# EAGLE design ramanPi_controlBoard (EAGLE 6.2)
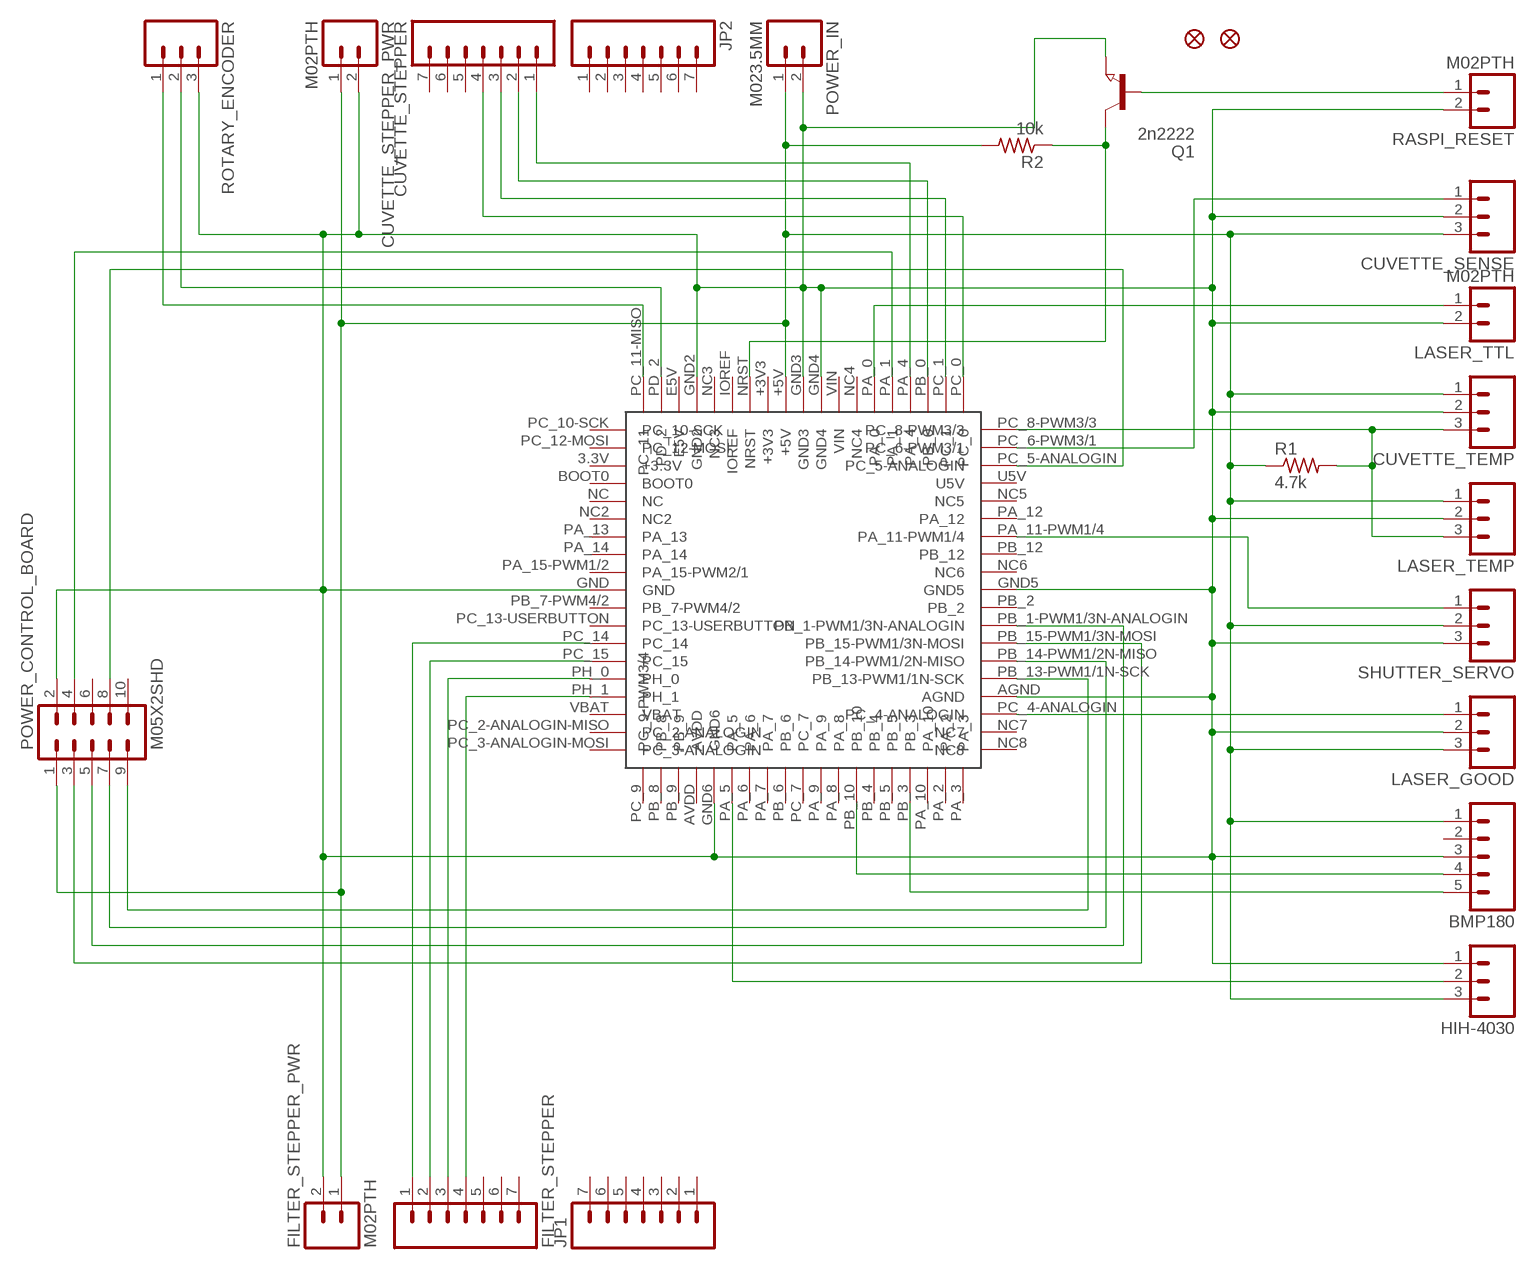
[diagram p0: schematic, sheet 1]

## Parts
BMP180  M05PTH  [1X05]
CUVETTE_SENSE  M03PTH  [1X03]
CUVETTE_STEPPER  M07  [1X07]
CUVETTE_STEPPER_PWR  M02PTH  [1X02]
CUVETTE_TEMP  M03PTH  [1X03]
FID1  FIDUCIAL1X2  [FIDUCIAL-1X2]
FID2  FIDUCIAL1X2  [FIDUCIAL-1X2]
FILTER_STEPPER  M07  [1X07]
FILTER_STEPPER_PWR  M02PTH  [1X02]
HIH-4030  M03PTH  [1X03]
JP1  M07  [1X07]
JP2  M07  [1X07]
LASER_GOOD  M03PTH  [1X03]
LASER_TEMP  M03PTH  [1X03]
LASER_TTL  M02PTH  [1X02]
POWER_CONTROL_BOARD  M05X2SHD  [2X5-SHROUDED]
POWER_IN  M023.5MM  [SCREWTERMINAL-3.5MM-2]
Q1  2n2222  NPN-TRANSISTOR_SOT23  [SOT23]
R1  4.7k  R-US_M1206  [M1206]
R2  10k  R-US_M1206  [M1206]
RASPI_RESET  M02PTH  [1X02]
ROTARY_ENCODER  M03PTH  [1X03]
SHUTTER_SERVO  M03PTH  [1X03]
U$1  STNUCLEOF401RE  [F401-RE]

## Nets
+5V: BMP180.1 CUVETTE_SENSE.3 CUVETTE_STEPPER_PWR.1 CUVETTE_TEMP.1 FILTER_STEPPER_PWR.1 HIH-4030.3 LASER_GOOD.3 LASER_TEMP.1 POWER_CONTROL_BOARD.1 POWER_IN.1 R1.1 R2.2 SHUTTER_SERVO.2 U$1.+5V
GROUND: BMP180.3 CUVETTE_SENSE.2 CUVETTE_STEPPER_PWR.2 CUVETTE_TEMP.2 FILTER_STEPPER_PWR.2 HIH-4030.1 LASER_GOOD.2 LASER_TEMP.2 LASER_TTL.2 POWER_CONTROL_BOARD.2 POWER_IN.2 Q1.2(E) RASPI_RESET.2 ROTARY_ENCODER.3 SHUTTER_SERVO.3 U$1.AGND U$1.GND U$1.GND2 U$1.GND3 U$1.GND4 U$1.GND5 U$1.GND6
N$1: BMP180.5 U$1.PB_3
N$2: BMP180.4 U$1.PB_10
N$4: CUVETTE_SENSE.1 U$1.PC_6-PWM3/1
N$5: HIH-4030.2 U$1.PA_5
N$6: CUVETTE_TEMP.3 LASER_TEMP.3 R1.2 U$1.PC_8-PWM3/3
N$7: POWER_CONTROL_BOARD.4 U$1.PA_1
N$8: LASER_TTL.1 U$1.PA_0
N$9: POWER_CONTROL_BOARD.3 U$1.PB_15-PWM1/3N-MOSI
N$10: POWER_CONTROL_BOARD.5 U$1.PB_1-PWM1/3N-ANALOGIN
N$11: POWER_CONTROL_BOARD.7 U$1.PB_14-PWM1/2N-MISO
N$12: POWER_CONTROL_BOARD.9 U$1.PB_13-PWM1/1N-SCK
N$13: POWER_CONTROL_BOARD.8 U$1.PC_5-ANALOGIN
N$14: SHUTTER_SERVO.1 U$1.PA_11-PWM1/4
N$15: LASER_GOOD.1 U$1.PC_4-ANALOGIN
N$16: FILTER_STEPPER.1 U$1.PC_14
N$17: FILTER_STEPPER.2 U$1.PC_15
N$18: FILTER_STEPPER.3 U$1.PH_0
N$19: FILTER_STEPPER.4 U$1.PH_1
N$20: CUVETTE_STEPPER.1 U$1.PA_4
N$21: CUVETTE_STEPPER.2 U$1.PB_0
N$22: CUVETTE_STEPPER.3 U$1.PC_1
N$23: CUVETTE_STEPPER.4 U$1.PC_0
N$24: ROTARY_ENCODER.1 U$1.PC_11-MISO(PC_11)
N$25: ROTARY_ENCODER.2 U$1.PD_2
N$49: Q1.3(C) R2.1 U$1.NRST
N$50: Q1.1(B) RASPI_RESET.1
Unconnected: BMP180.2 CUVETTE_STEPPER.5 CUVETTE_STEPPER.6 CUVETTE_STEPPER.7 FILTER_STEPPER.5 FILTER_STEPPER.6 FILTER_STEPPER.7 JP1.1 JP1.2 JP1.3 JP1.4 JP1.5 JP1.6 JP1.7 JP2.1 JP2.2 JP2.3 JP2.4 JP2.5 JP2.6 JP2.7 POWER_CONTROL_BOARD.6 POWER_CONTROL_BOARD.10 U$1.BOOT0 U$1.IOREF U$1.NC U$1.NC2 U$1.NC3 U$1.NC4 U$1.NC5 U$1.NC6 U$1.NC7 U$1.NC8 U$1.PA_2 U$1.PA_3 U$1.PA_6 U$1.PA_7 U$1.PA_8 U$1.PA_9 U$1.PA_10 U$1.PA_12 U$1.PA_13 U$1.PA_14 U$1.PA_15-PWM1/2(PA_15-PWM2/1) U$1.PB_2 U$1.PB_4 U$1.PB_5 U$1.PB_6 U$1.PB_7-PWM4/2 U$1.PB_8 U$1.PB_9 U$1.PB_12 U$1.PC_2-ANALOGIN-MISO(PC_2-ANALOGIN) U$1.PC_3-ANALOGIN-MOSI(PC_3-ANALOGIN) U$1.PC_7 U$1.PC_9(PC_9-PWM3/4) U$1.PC_10-SCK U$1.PC_12-MOSI U$1.PC_13-USERBUTTON

## Power pins joined to a net without a drawn wire
+3.3V: U$1.3.3V(+3.3V)
+3V3: U$1.+3V3
AVDD: U$1.AVDD
E5V: U$1.E5V
U5V: U$1.U5V
VBAT: U$1.VBAT
VIN: U$1.VIN

## Library data of the parts
BMP180 = SparkFun-Connectors:M05: Header 5 Standard 5-pin 0.1" header. Use with straight break away headers (SKU : PRT-00116), right angle break away headers (PRT-00553), swiss pins (PRT-00743), machine pins (PRT-00117), and female headers (PRT-00115). Molex polarized connector foot print use with SKU : PRT-08230 with associated crimp pins and housings.
CUVETTE_SENSE CUVETTE_TEMP HIH-4030 LASER_GOOD LASER_TEMP ROTARY_ENCODER SHUTTER_SERVO = SparkFun-Connectors:M03: Header 3 Standard 3-pin 0.1" header. Use with straight break away headers (SKU : PRT-00116), right angle break away headers (PRT-00553), swiss pins (PRT-00743), machine pins (PRT-00117), and female headers (PRT-00115). Molex polarized connector foot print use with SKU : PRT-08232 with associated crimp pins and housings.
CUVETTE_STEPPER FILTER_STEPPER JP1 JP2 = SparkFun-Connectors:M07: Header 7 Standard 7-pin 0.1" header. Use with straight break away headers (SKU : PRT-00116), right angle break away headers (PRT-00553), swiss pins (PRT-00743), machine pins (PRT-00117), and female headers (PRT-00115). NOTES ON THE VARIANTS LOCK and LOCK_LONGPADS... This footprint was designed to help hold the alignment of a through-hole component (i.e. 7-pin header) while soldering it into place. You may notice that each hole has been shifted either up or down by 0.005 of an inch from it's more standard position (which is usually a perfectly straight line). This slight alteration caused the pins (the squares in the middle) to touch the edges of the holes. Because they are alternating, it causes a "brace" to hold the header in place. 0.005 has proven to be the perfect amount of "off-center" position when using our standard breakaway headers. Although looks a little odd when you look at the bare footprint, once you have a header in there, the alteration is very hard to notice. Also, if you push a header all the way into place, it is covered up entirely on the bottom side. This idea of altering the position of holes to aid alignment will be further integrated into the Sparkfun Library for other footprints. It can help hold any component with 3 or more connection pins.
CUVETTE_STEPPER_PWR FILTER_STEPPER_PWR LASER_TTL POWER_IN RASPI_RESET = SparkFun-Connectors:M02: Standard 2-pin 0.1" header. Use with - straight break away headers ( PRT-00116) - right angle break away headers (PRT-00553) - swiss pins (PRT-00743) - machine pins (PRT-00117) - female headers (PRT-00115) Molex polarized connector foot print use with: PRT-08233 with associated crimp pins and housings. 2.54_SCREWTERM for use with PRT-10571. 3.5mm Screw Terminal footprints for PRT-08084 5mm Screw Terminal footprints for use with PRT-08433
FID1 FID2 = SparkFun-Aesthetics:FIDUCIAL: Fiducial Alignment Points Various fiducial points for machine vision alignment.
POWER_CONTROL_BOARD = SparkFun-Connectors:M05X2: Header 5x2 Standard 10-pin dual row 0.1" header. Commonly used with AVR-ISP. Use with Spark Fun Electronics SKU: PRT-00778
Q1 = semicon-smd-ipc:NPN-TRANSISTOR_: NPN TRANSISTOR
R1 R2 = adafruit:R-US_: RESISTOR, American symbol
U$1 = nucleoF401RE:STNUCLEOF401RE

## Board
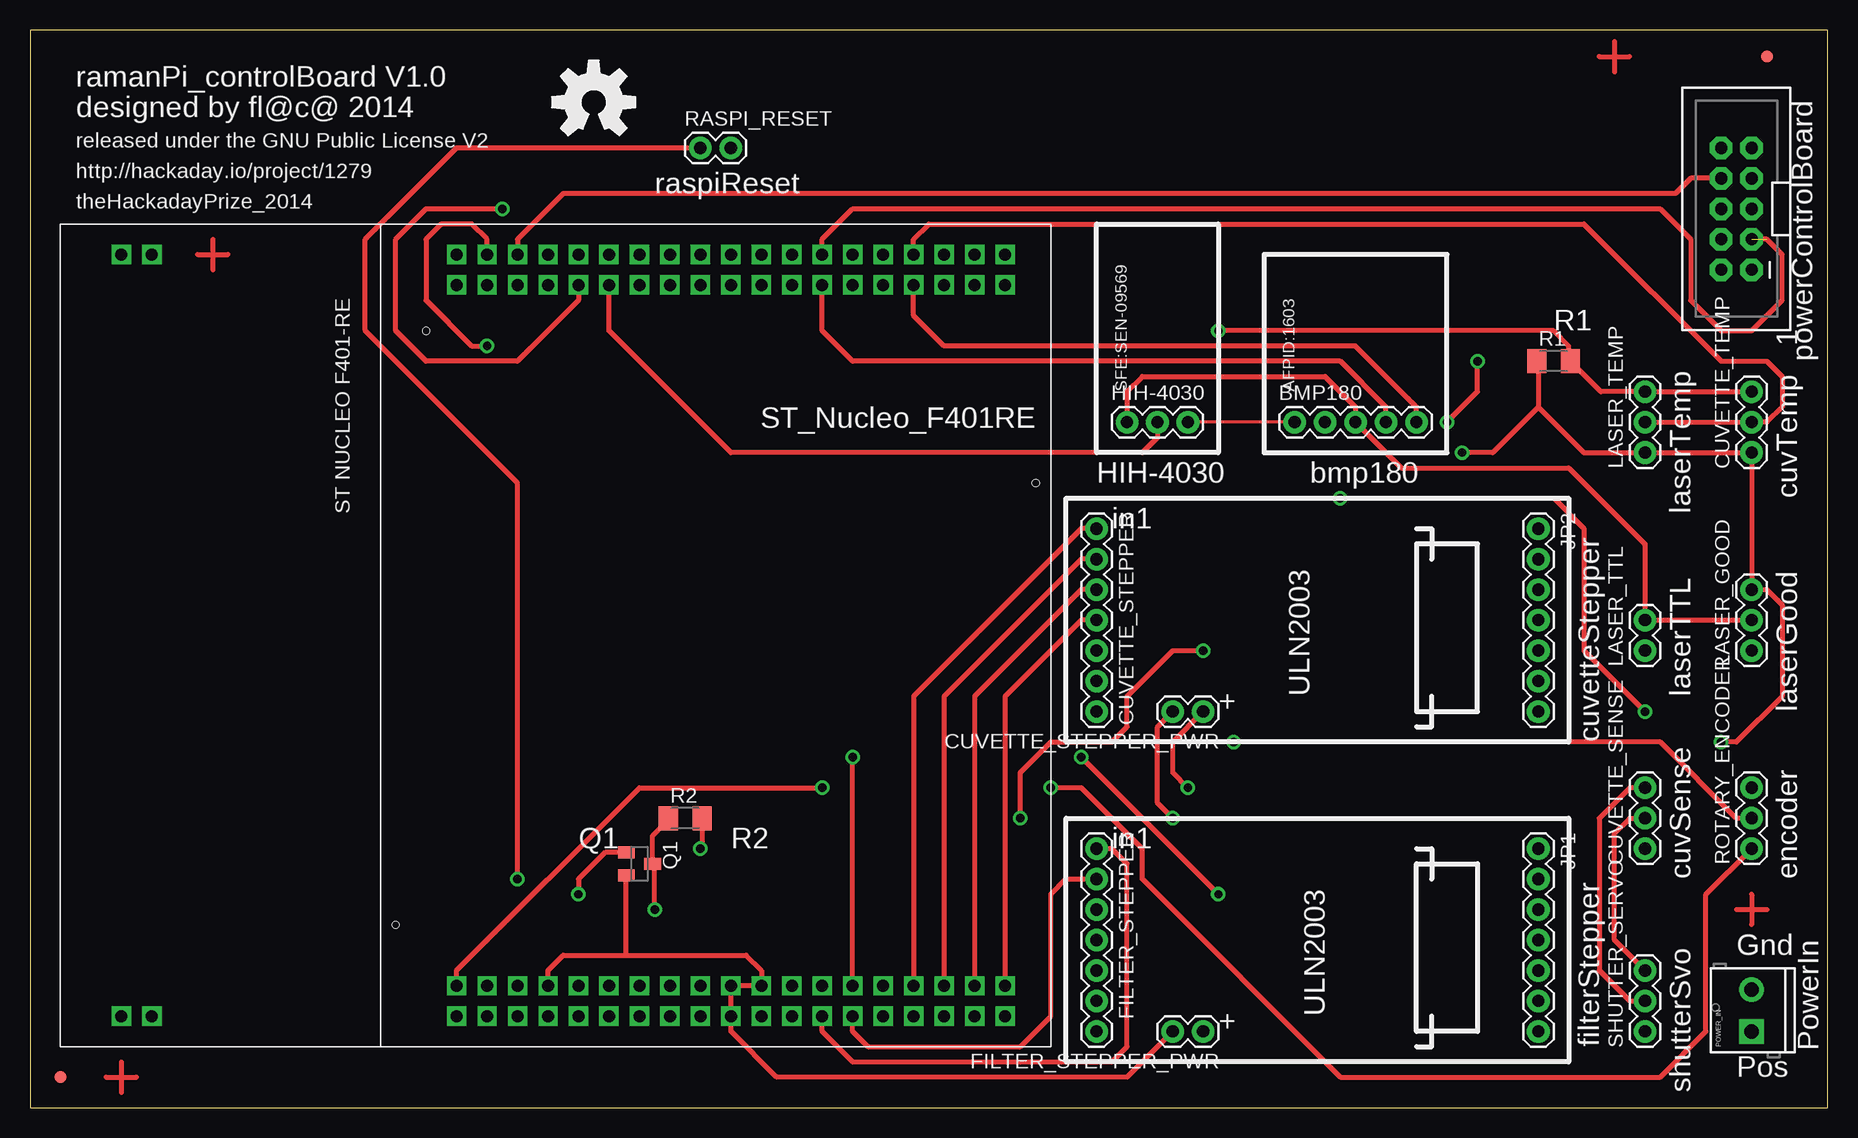
[diagram p1: board, top side]
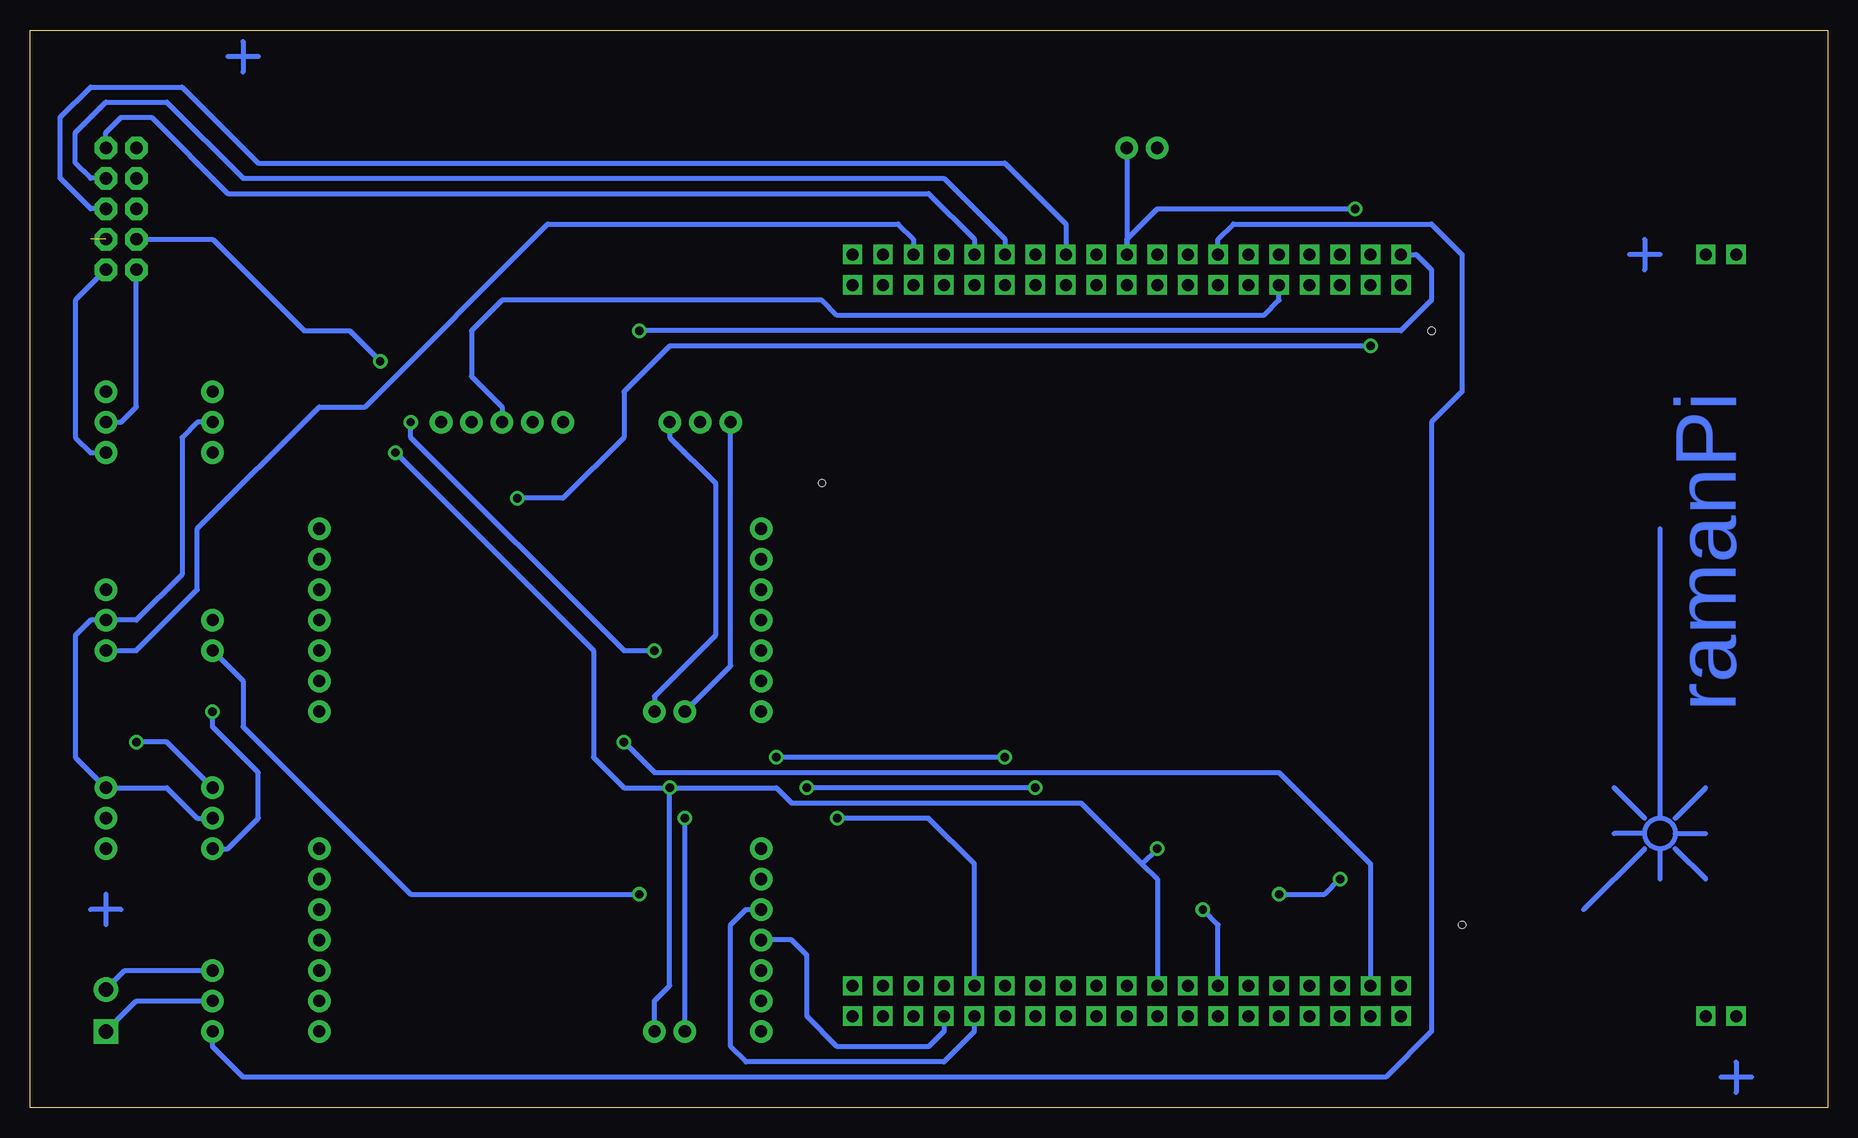
[diagram p2: board, bottom side, seen from below]

Size 149.84 x 89.84 mm. Coordinates in mm from the lower left corner, seen from the top.
Outline: 0,0 149.84,0 149.84,89.84 0,89.84 0,0
Copper layers (1*16): Top 0.035mm / dielectric 1.5mm / Bottom 0.035mm
Design rules: minimum track width 8mil, minimum drill 20mil, track to track 8mil, track to pad 8mil, pad to pad 8mil, via to via 8mil, smd to smd 8mil, copper to edge 10mil, drill to drill 8mil, minimum pad ring 12mil, minimum via ring 10mil, stop-mask expansion 4mil, vias tented up to drill 25mil, thermal gap 10mil

### Footprints (pad centres in the part's own frame; a part is rotated, then mirrored left to right if it is on the bottom)
1X05 = drill 1.016 pad 1.88: 1 0,0; 2 2.54,0; 3 5.08,0; 4 7.62,0; 5 10.16,0
1X03 = drill 1.016 pad 1.88: 1 0,0; 2 2.54,0; 3 5.08,0
1X07 = drill 1.016 pad 1.88: 1 0,0; 2 2.54,0; 3 5.08,0; 4 7.62,0; 5 10.16,0; 6 12.7,0; 7 15.24,0
1X02 = drill 1.016 pad 1.88: 1 0,0; 2 2.54,0
FIDUCIAL-1X2 = smd 1 x 1: 1 0,0
2X5-SHROUDED = drill 1.016 pad 1.88 octagon: 1 -1.27,5.08; 2 1.27,5.08; 3 -1.27,2.54; 4 1.27,2.54; 5 -1.27,0; 6 1.27,0; 7 -1.27,-2.54; 8 1.27,-2.54; 9 -1.27,-5.08; 10 1.27,-5.08
SCREWTERMINAL-3.5MM-2 = drill 1.2 pad 2.032 square: 1 0,0 | drill 1.2 pad 2.032: 2 3.5,0
SOT23 = smd 1 x 1.4: 1 -0.95,-1.1; 2 0.95,-1.1; 3 0,1.1
M1206 = smd 1.6 x 2: 1 -1.4,0; 2 1.4,0
F401-RE = drill 1 square: 3.3V 2.54,44.45; +3V3 5.08,31.75; +5V 5.08,29.21; AGND 66.04,11.43; AVDD 63.5,41.91; BOOT0 2.54,41.91; E5V 5.08,44.45; GND 2.54,26.67; GND2 5.08,41.91; GND3 5.08,26.67; GND4 5.08,24.13; GND5 63.5,39.37; GND6 66.04,26.67; IOREF 5.08,36.83; NC 2.54,39.37; NC2 2.54,36.83; NC3 5.08,39.37; NC4 5.08,19.05; NC5 66.04,39.37; NC6 66.04,29.21; NC7 66.04,6.35; NC8 66.04,3.81; NRST 5.08,34.29; P$1 66.04,77.47; P$2 66.04,74.93; P$3 2.54,77.47; P$4 2.54,74.93; PA_0 5.08,16.51; PA_1 5.08,13.97; PA_2 63.5,6.35; PA_3 63.5,3.81; PA_4 5.08,11.43; PA_5 63.5,36.83; PA_6 63.5,34.29; PA_7 63.5,31.75; PA_8 63.5,21.59; PA_9 63.5,24.13; PA_10 63.5,8.89; PA_11-PWM1/4 66.04,34.29; PA_12 66.04,36.83; PA_13 2.54,34.29; PA_14 2.54,31.75; PA_15-PWM1/2 2.54,29.21; PB_0 5.08,8.89; PB_1-PWM1/3N-ANALOGIN 66.04,21.59; PB_2 66.04,24.13; PB_3 63.5,11.43; PB_4 63.5,16.51; PB_5 63.5,13.97; PB_6 63.5,29.21; PB_7-PWM4/2 2.54,24.13; PB_8 63.5,46.99; PB_9 63.5,44.45; PB_10 63.5,19.05; PB_12 66.04,31.75; PB_13-PWM1/1N-SCK 66.04,13.97; PB_14-PWM1/2N-MISO 66.04,16.51; PB_15-PWM1/3N-MOSI 66.04,19.05; PC_0 5.08,3.81; PC_1 5.08,6.35; PC_2-ANALOGIN-MISO 2.54,6.35; PC_3-ANALOGIN-MOSI 2.54,3.81; PC_4-ANALOGIN 66.04,8.89; PC_5-ANALOGIN 66.04,44.45; PC_6-PWM3/1 66.04,46.99; PC_7 63.5,26.67; PC_8-PWM3/3 66.04,49.53; PC_9 63.5,49.53; PC_10-SCK 2.54,49.53; PC_11-MISO 5.08,49.53; PC_12-MOSI 2.54,46.99; PC_13-USERBUTTON 2.54,21.59; PC_14 2.54,19.05; PC_15 2.54,16.51; PD_2 5.08,46.99; PH_0 2.54,13.97; PH_1 2.54,11.43; U5V 66.04,41.91; VBAT 2.54,8.89; VIN 5.08,21.59 | hole 0.6: 46.99,1.27; 10.16,54.61; 59.69,52.07

### Placement (x,y rotation side)
BMP180  105.41,57.15 0 top
CUVETTE_SENSE  134.62,21.59 90 top
CUVETTE_STEPPER  88.9,48.26 270 top
CUVETTE_STEPPER_PWR  97.79,33.02 180 top
CUVETTE_TEMP  143.51,54.61 90 top
FID1  2.54,2.54 0 top
FID2  144.78,87.63 0 top
FILTER_STEPPER  88.9,21.59 270 top
FILTER_STEPPER_PWR  97.79,6.35 180 top
HIH-4030  91.44,57.15 0 top
JP1  125.73,21.59 270 top
JP2  125.73,48.26 270 top
LASER_GOOD  143.51,38.1 90 top
LASER_TEMP  134.62,54.61 90 top
LASER_TTL  134.62,38.1 90 top
POWER_CONTROL_BOARD  142.24,74.93 180 top
POWER_IN  143.51,6.35 90 top
Q1  50.8,20.32 270 top
R1  127,62.23 0 top
R2  54.61,24.13 0 top
RASPI_RESET  55.88,80.01 0 top
ROTARY_ENCODER  143.51,21.59 90 top
SHUTTER_SERVO  134.62,6.35 90 top
U$1  85.09,5.08 90 top
U$2  [OSHW-LOGO-L]  46.99,83.82 0 top

### Tracks (layer width: path | path; a pad name or v marks a point on that pad's centre or on a via)
+5V  (via drill 0.7)
  Top 0.254: BMP180.1 HIH-4030.3 | 125.73,62.23 R1.1
  Top 0.406: 125.73,62.23 125.73,58.42 | 125.73,58.42 129.54,54.61 LASER_TEMP.1 CUVETTE_TEMP.1 LASER_GOOD.3 144.78,43.18 146.05,41.91 146.05,34.29 142.24,30.48 v140.97,30.48 | v96.52,26.67 95.25,27.94 95.25,30.48 CUVETTE_STEPPER_PWR.1 | 125.73,58.42 121.92,54.61 v119.38,54.61 | CUVETTE_SENSE.3 133.35,26.67 130.81,24.13 130.81,11.43 133.35,8.89 SHUTTER_SERVO.2 | R2.2 56.01,21.72 v55.88,21.59
  Bottom 0.406: HIH-4030.3 96.52,55.88 92.71,52.07 92.71,39.37 97.79,34.29 CUVETTE_STEPPER_PWR.1 | FILTER_STEPPER_PWR.1 97.79,8.89 96.52,10.16 v96.52,26.67 | v119.38,54.61 102.87,38.1 102.87,29.21 100.33,26.67 v96.52,26.67 | 57.15,20.32 62.23,25.4 86.36,25.4 87.63,26.67 v96.52,26.67 | 57.15,20.32 55.88,19.05 U$1.+5V | POWER_CONTROL_BOARD.1 146.05,67.31 146.05,55.88 144.78,54.61 CUVETTE_TEMP.1 | POWER_IN.1 140.97,8.89 SHUTTER_SERVO.2 | CUVETTE_SENSE.3 138.43,30.48 v140.97,30.48 | 57.15,20.32 v55.88,21.59
GROUND  (via drill 0.7)
  Top 0.406: LASER_TEMP.2 CUVETTE_TEMP.2 144.78,57.15 146.05,58.42 146.05,60.96 144.78,62.23 140.97,62.23 129.54,73.66 74.93,73.66 73.66,72.39 U$1.AGND | LASER_GOOD.2 LASER_TTL.2 134.62,46.99 128.27,53.34 114.3,53.34 BMP180.3 110.49,58.42 107.95,60.96 92.71,60.96 91.44,59.69 HIH-4030.1 | v95.25,24.13 93.98,25.4 93.98,31.75 CUVETTE_STEPPER_PWR.2 | U$1.GND2 43.18,11.43 44.45,12.7 49.7,12.7 | 49.7,12.7 59.69,12.7 60.96,11.43 U$1.GND4 U$1.GND3 U$1.GND 58.42,6.35 62.23,2.54 91.44,2.54 FILTER_STEPPER_PWR.2 | SHUTTER_SERVO.3 132.08,13.97 132.08,22.86 133.35,24.13 CUVETTE_SENSE.2 | U$1.GND5 45.72,67.31 40.64,62.23 33.02,62.23 30.48,64.77 30.48,72.39 33.02,74.93 v39.37,74.93 | 49.7,12.7 Q1.2
  Bottom 0.406: CUVETTE_SENSE.2 135.89,24.13 138.43,26.67 ROTARY_ENCODER.3 146.05,29.21 146.05,39.37 144.78,40.64 LASER_GOOD.2 140.97,40.64 137.16,44.45 137.16,55.88 135.89,57.15 LASER_TEMP.2 | CUVETTE_STEPPER_PWR.2 91.44,36.83 HIH-4030.1 | FILTER_STEPPER_PWR.2 v95.25,24.13 | BMP180.3 110.49,58.42 113.03,60.96 113.03,64.77 110.49,67.31 83.82,67.31 82.55,66.04 46.99,66.04 45.72,67.31 U$1.GND5 | CUVETTE_TEMP.2 142.24,57.15 140.97,58.42 POWER_CONTROL_BOARD.2 | POWER_IN.2 141.93,11.43 SHUTTER_SERVO.3 | v39.37,74.93 55.88,74.93 58.42,72.39 U$1.GND6 RASPI_RESET.2
N$1
  Top 0.406: BMP180.5 115.57,58.42 110.49,63.5 76.2,63.5 73.66,66.04 U$1.PB_3
N$2
  Top 0.406: BMP180.4 113.03,58.42 109.22,62.23 68.58,62.23 66.04,64.77 U$1.PB_10
N$3
  Bottom 0.406: 13.97,48.26 13.97,24.13
N$4  (via drill 0.7)
  Top 0.406: U$1.PC_6-PWM3/1 38.1,72.39 36.83,73.66 34.29,73.66 33.02,72.39 33.02,67.31 36.83,63.5 v38.1,63.5 | v109.22,50.8 127,50.8 129.54,48.26 129.54,38.1 v134.62,33.02
  Bottom 0.406: v38.1,63.5 96.52,63.5 100.33,59.69 100.33,55.88 105.41,50.8 v109.22,50.8 | CUVETTE_SENSE.1 133.35,21.59 130.81,24.13 130.81,27.94 134.62,31.75 v134.62,33.02
N$5
  Top 0.406: HIH-4030.2 93.98,55.88 92.71,54.61 58.42,54.61 48.26,64.77 U$1.PA_5
N$6  (via drill 0.7)
  Top 0.406: CUVETTE_TEMP.3 LASER_TEMP.3 130.94,59.69 R1.2 128.27,62.36 128.27,63.5 127,64.77 v99.06,64.77
  Bottom 0.406: U$1.PC_8-PWM3/3 34.29,71.12 33.02,69.85 33.02,67.31 35.56,64.77 v99.06,64.77
N$7  (via drill 0.7)
  Top 0.406: v82.55,24.13 82.55,27.94 85.09,30.48 90.17,30.48 91.44,31.75 91.44,34.29 95.25,38.1 v97.79,38.1 | v118.11,57.15 120.65,59.69 v120.65,62.23
  Bottom 0.406: POWER_CONTROL_BOARD.4 134.62,72.39 127,64.77 123.19,64.77 v120.65,62.23 | v97.79,38.1 100.33,38.1 118.11,55.88 v118.11,57.15 | U$1.PA_1 71.12,20.32 74.93,24.13 v82.55,24.13
N$8  (via drill 0.7)
  Top 0.406: U$1.PA_0 v68.58,29.21 | v87.63,29.21 v99.06,17.78
  Bottom 0.406: LASER_TTL.1 132.08,35.56 132.08,31.75 118.11,17.78 v99.06,17.78 | v68.58,29.21 v87.63,29.21
N$9  (1 unrouted)
  Top 0.406: POWER_CONTROL_BOARD.3 144.78,72.39 146.05,71.12 146.05,67.31 143.51,64.77 140.97,64.77 138.43,67.31 138.43,72.39 135.89,74.93 68.58,74.93 66.04,72.39 U$1.PB_15-PWM1/3N-MOSI
N$10
  Bottom 0.406: POWER_CONTROL_BOARD.5 144.78,74.93 147.32,77.47 147.32,82.55 144.78,85.09 137.16,85.09 130.81,78.74 68.58,78.74 63.5,73.66 U$1.PB_1-PWM1/3N-ANALOGIN
N$11
  Bottom 0.406: POWER_CONTROL_BOARD.7 144.78,77.47 146.05,78.74 146.05,81.28 143.51,83.82 138.43,83.82 132.08,77.47 73.66,77.47 68.58,72.39 U$1.PB_14-PWM1/2N-MISO
N$12
  Bottom 0.406: POWER_CONTROL_BOARD.9 143.51,81.28 142.24,82.55 139.7,82.55 133.35,76.2 74.93,76.2 71.12,72.39 U$1.PB_13-PWM1/1N-SCK
N$13
  Top 0.406: POWER_CONTROL_BOARD.8 138.43,77.47 137.16,76.2 44.45,76.2 40.64,72.39 U$1.PC_5-ANALOGIN
N$14
  Bottom 0.406: U$1.PA_11-PWM1/4 50.8,72.39 49.53,73.66 33.02,73.66 30.48,71.12 30.48,59.69 33.02,57.15 33.02,6.35 36.83,2.54 132.08,2.54 134.62,5.08 SHUTTER_SERVO.1
N$15
  Bottom 0.406: LASER_GOOD.1 140.97,38.1 135.89,43.18 135.89,48.26 125.73,58.42 121.92,58.42 106.68,73.66 77.47,73.66 76.2,72.39 U$1.PC_4-ANALOGIN
N$16
  Top 0.406: FILTER_STEPPER.1 90.17,21.59 91.44,20.32 91.44,5.08 90.17,3.81 68.58,3.81 66.04,6.35 U$1.PC_14
N$17
  Top 0.406: FILTER_STEPPER.2 86.36,19.05 85.09,17.78 85.09,7.62 82.55,5.08 69.85,5.08 68.58,6.35 U$1.PC_15
N$18
  Bottom 0.406: FILTER_STEPPER.3 90.17,16.51 91.44,15.24 91.44,5.08 90.17,3.81 73.66,3.81 71.12,6.35 U$1.PH_0
N$19
  Bottom 0.406: U$1.PH_1 73.66,6.35 74.93,5.08 82.55,5.08 85.09,7.62 85.09,12.7 86.36,13.97 FILTER_STEPPER.4
N$20
  Top 0.406: CUVETTE_STEPPER.1 87.63,48.26 73.66,34.29 U$1.PA_4
N$21
  Top 0.406: CUVETTE_STEPPER.2 87.63,45.72 76.2,34.29 U$1.PB_0
N$22
  Top 0.406: CUVETTE_STEPPER.3 87.63,43.18 78.74,34.29 U$1.PC_1
N$23
  Top 0.406: CUVETTE_STEPPER.4 87.63,40.64 81.28,34.29 U$1.PC_0
N$24  (via drill 0.7)
  Top 0.406: U$1.PC_11-MISO 35.56,11.43 50.8,26.67 v66.04,26.67 | v85.09,26.67 87.63,26.67 92.71,21.59 92.71,19.05 109.22,2.54 135.89,2.54 139.7,6.35 139.7,17.78 ROTARY_ENCODER.1
  Bottom 0.406: v66.04,26.67 v85.09,26.67
N$25  (via drill 0.7)
  Top 0.406: ROTARY_ENCODER.2 142.24,24.13 135.89,30.48 v100.33,30.48
  Bottom 0.406: v100.33,30.48 97.79,27.94 45.72,27.94 38.1,20.32 U$1.PD_2
N$26
  Bottom 0.406: 15.24,22.86 17.78,22.86
N$27
  Bottom 0.406: 13.97,21.59 13.97,19.05
N$28
  Bottom 0.406: 12.7,22.86 10.16,22.86
N$29
  Bottom 0.406: 15.24,24.13 17.78,26.67
N$30
  Bottom 0.406: 12.7,21.59 10.16,19.05
N$31
  Bottom 0.406: 15.24,21.59 20.32,16.51
N$32
  Bottom 0.406: 12.7,24.13 10.16,26.67
N$33
  Bottom 0.406: 7.62,3.81 7.62,1.27
N$34
  Bottom 0.406: 6.35,2.54 8.89,2.54
N$35
  Bottom 0.406: 15.24,72.39 15.24,69.85
N$36
  Bottom 0.406: 13.97,71.12 16.51,71.12
N$37
  Bottom 0.406: 132.08,88.9 132.08,86.36
N$38
  Bottom 0.406: 130.81,87.63 133.35,87.63
N$39
  Bottom 0.406: 143.51,17.78 143.51,15.24
N$40
  Bottom 0.406: 142.24,16.51 144.78,16.51
N$41
  Top 0.406: 15.24,72.39 15.24,69.85
N$42
  Top 0.406: 13.97,71.12 16.51,71.12
N$43
  Top 0.406: 7.62,3.81 7.62,1.27
N$44
  Top 0.406: 6.35,2.54 8.89,2.54
N$45
  Top 0.406: 132.08,88.9 132.08,86.36
N$46
  Top 0.406: 130.81,87.63 133.35,87.63
N$47
  Top 0.406: 143.51,17.78 143.51,15.24
N$48
  Top 0.406: 142.24,16.51 144.78,16.51
N$49  (via drill 0.7)
  Top 0.406: R2.1 53.34,24.13 51.9,22.69 Q1.3 52.07,20.15 v52.07,16.51
  Bottom 0.406: U$1.NRST 50.8,15.24 v52.07,16.51
N$50  (via drill 0.7)
  Top 0.406: Q1.1 47.94,21.27 45.72,19.05 v45.72,17.78 | v40.64,19.05 40.64,52.07 27.94,64.77 27.94,72.39 35.56,80.01 RASPI_RESET.1
  Bottom 0.406: v45.72,17.78 41.91,17.78 v40.64,19.05
(copper drawn outside any net)
  shapes: Bottom circle x1

### Text on the board
Bottom: ramanPi
tPlace: ramanPi_controlBoard V1.0 | designed by fl@c@ 2014 | released under the GNU Public License V2 | http://hackaday.io/project/1279 | raspiReset | theHackadayPrize_2014 | R1 | 1 | powerControlBoard | SFE:SEN-09569 | AFPID:1603 | ST_Nucleo_F401RE | HIH-4030 | bmp180 | cuvTemp | laserTemp | in1 | ULN2003 | laserTTL | + | laserGood | cuvetteStepper | Q1 | R2 | in1 | cuvSense | encoder | PowerIn | Gnd | ULN2003 | + | filterStepper | Pos | shutterSvo